# EAGLE design OLED Watch Original Design (EAGLE 9.0.1)
Assembly variants: DNP
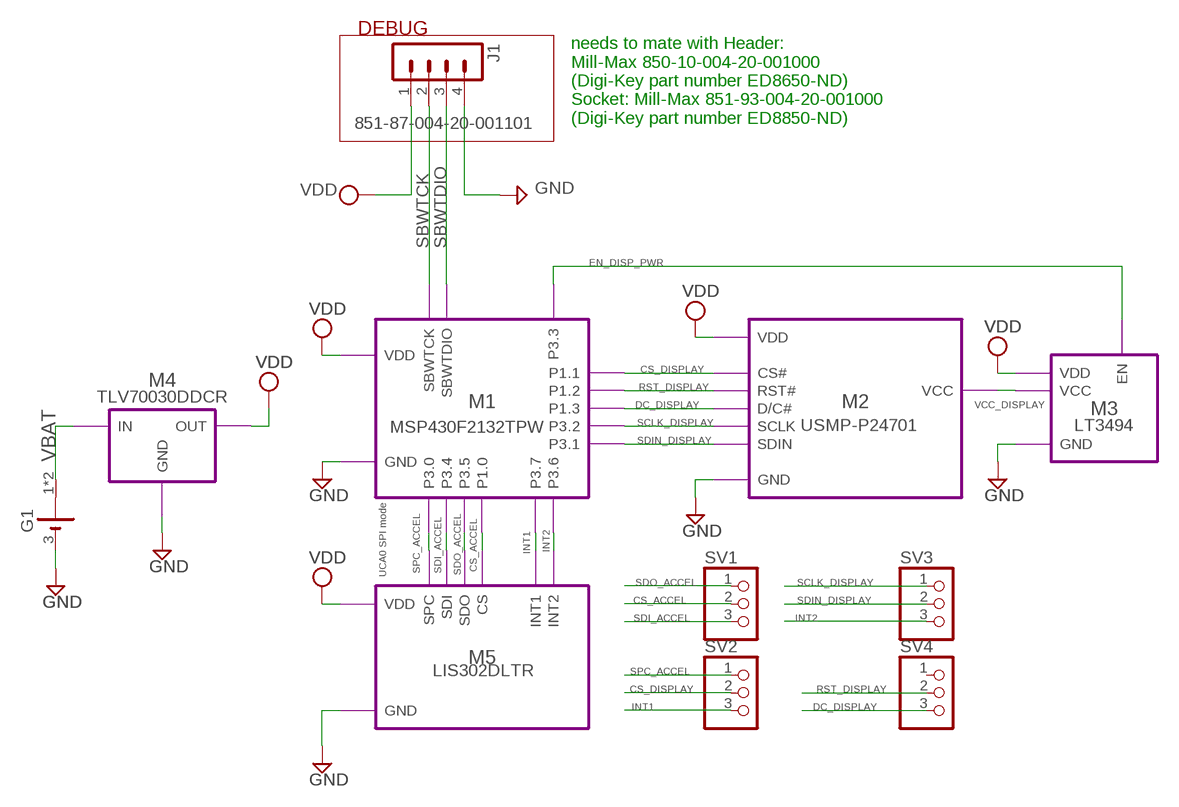
[diagram p0: schematic, sheet 1]

## Parts
G1  CR2025H  [CR2025H]
J1  851-87-004-20-001101  [851-87-004-20-001101]  (not fitted in variant DNP)
SV1  PINHD-1X3  [1X03]  (not fitted in variant DNP)
SV2  PINHD-1X3  [1X03]  (not fitted in variant DNP)
SV3  PINHD-1X3  [1X03]  (not fitted in variant DNP)
SV4  PINHD-1X3  [1X03]  (not fitted in variant DNP)

## Module instances
M1 = PROCESSOR
M5 = ACCEL
M2 = DISPLAY
M3 = DPWR
M4 = VREG

## Nets
CS_ACCEL: SV1.2 ; port M1.P1.0 M5.CS
CS_DISPLAY: SV2.2 ; port M1.P1.1 M2.CS#
DC_DISPLAY: SV4.3 ; port M1.P1.3 M2.D/C#
EN_DISP_PWR: port M1.P3.3 M3.EN
GND: G1.3(-) J1.4 ; port M5.GND M2.GND M3.GND M1.GND M4.GND
INT1: SV2.3 ; port M1.P3.7 M5.INT1
INT2: SV3.3 ; port M1.P3.6 M5.INT2
RST_DISPLAY: SV4.2 ; port M1.P1.2 M2.RST#
SBWTCK: J1.2 ; port M1.SBWTCK
SBWTDIO: J1.3 ; port M1.SBWTDIO
SCLK_DISPLAY: SV3.1 ; port M1.P3.2 M2.SCLK
SDI_ACCEL: SV1.3 ; port M1.P3.4 M5.SDI
SDIN_DISPLAY: SV3.2 ; port M1.P3.1 M2.SDIN
SDO_ACCEL: SV1.1 ; port M1.P3.5 M5.SDO
SPC_ACCEL: SV2.1 ; port M1.P3.0 M5.SPC
VBAT: G1.1(+) G1.2(+) ; port M4.IN
VCC_DISPLAY: port M3.VCC M2.VCC
VDD: J1.1 ; port M2.VDD M1.VDD M3.VDD M5.VDD M4.OUT
Unconnected: SV4.1

## Notes on the sheet
- DEBUG
- needs to mate with Header: 
  Mill-Max 850-10-004-20-001000 
  (Digi-Key part number ED8650-ND)
  Socket: Mill-Max 851-93-004-20-001000 
  (Digi-Key part number ED8850-ND)
- TLV70030DDCR
- MSP430F2132TPW | USMP-P24701 | LT3494
- UCA0 SPI mode
- LIS302DLTR

## Library data of the parts
G1 = OLED Watch Original Library:CR2025H: LI BATTERY Panasonic
J1 = ewpartswatch@1:851-87-004-20-001101: 4 Position Socket Connector 0.050" (1.27mm) Through Hole, Right Angle Gold Digikey: 1212-1347-ND http://www.precidip.com/AppHost/9696,1/Scripts/Modules/Catalog/Default.aspx?c=7&i=204&p=80&pdf=1&dsku=851-PP-NNN-20-001101
SV1-SV4 = pinhead:PINHD-1X3: PIN HEADER

## Module PROCESSOR
Ports: VDD(pwr) GND(pwr) P3.1(out) P3.2(out) P1.3(out) P1.2(out) P1.1(out) P3.0(out) P3.4(out) P3.5(in) P3.7(in) P3.6(in) P1.0(out) P3.3(out) SBWTCK(io) SBWTDIO(io)
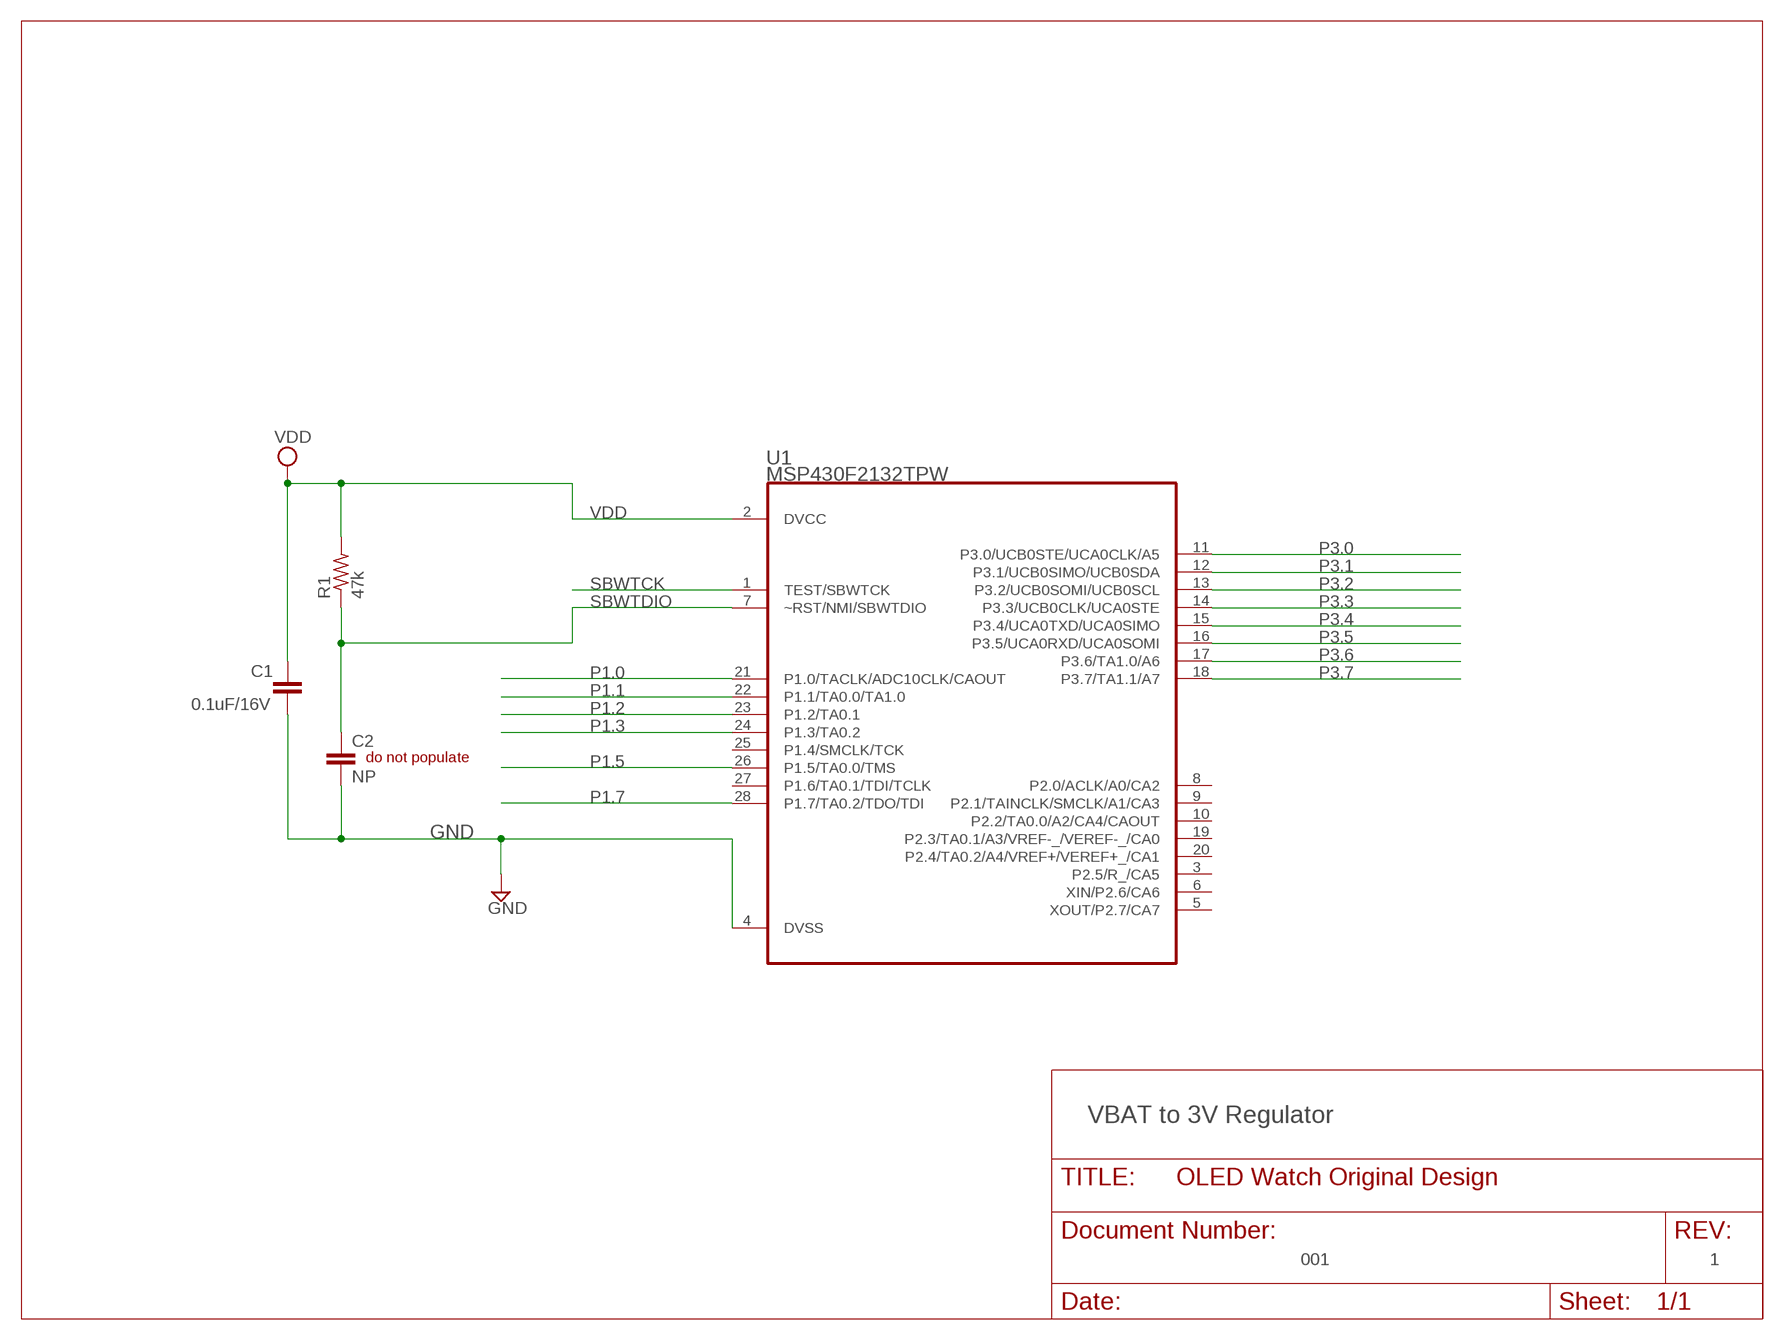
[diagram p1: schematic, module PROCESSOR, sheet 1]

### Parts
C1  0.1uF/16V  C-EUC0603  [C0603]
C2  NP  C-EUC0603  [C0603]  (not fitted in variant DNP)
R1  47k  R-US_R0603  [R0603]
U1  MSP430F2132TPW  [SOP-28N]

### Nets
GND: C1.2 C2.2 U1.4(DVSS)
P1.0: U1.21(P1.0/TACLK/ADC10CLK/CAOUT)
P1.1: U1.22(P1.1/TA0.0/TA1.0)
P1.2: U1.23(P1.2/TA0.1)
P1.3: U1.24(P1.3/TA0.2)
P1.5: U1.26(P1.5/TA0.0/TMS)
P1.7: U1.28(P1.7/TA0.2/TDO/TDI)
P3.0: U1.11(P3.0/UCB0STE/UCA0CLK/A5)
P3.1: U1.12(P3.1/UCB0SIMO/UCB0SDA)
P3.2: U1.13(P3.2/UCB0SOMI/UCB0SCL)
P3.3: U1.14(P3.3/UCB0CLK/UCA0STE)
P3.4: U1.15(P3.4/UCA0TXD/UCA0SIMO)
P3.5: U1.16(P3.5/UCA0RXD/UCA0SOMI)
P3.6: U1.17(P3.6/TA1.0/A6)
P3.7: U1.18(P3.7/TA1.1/A7)
SBWTCK: U1.1(TEST/SBWTCK)
SBWTDIO: C2.1 R1.1 U1.7(~RST/NMI/SBWTDIO)
VDD: C1.1 R1.2 U1.2(DVCC)
Unconnected: U1.3(P2.5/R_/CA5) U1.5(XOUT/P2.7/CA7) U1.6(XIN/P2.6/CA6) U1.8(P2.0/ACLK/A0/CA2) U1.9(P2.1/TAINCLK/SMCLK/A1/CA3) U1.10(P2.2/TA0.0/A2/CA4/CAOUT) U1.19(P2.3/TA0.1/A3/VREF-_/VEREF-_/CA0) U1.20(P2.4/TA0.2/A4/VREF+/VEREF+_/CA1) U1.25(P1.4/SMCLK/TCK) U1.27(P1.6/TA0.1/TDI/TCLK)

### Notes on the sheet
- do not populate
- VBAT to 3V Regulator
- 001 | 1

### Library data of the parts
C1 = rcl:C-EU: CAPACITOR, European symbol; DIGIKEY: 1276-2448-1-ND; SPICEPREFIX: C
C2 = rcl:C-EU: CAPACITOR, European symbol; DIGIKEY: 478-10068-1-ND; SPICEPREFIX: C
R1 = rcl:R-US_: RESISTOR, American symbol; DIGIKEY: 311-47KGRCT-ND; SPICEPREFIX: R
U1 = OLED Watch Original Library:MSP430F2132TPW: MIXED SIGNAL MICROCONTROLLER; DIGIKEY: 296-26202-5-ND

## Module ACCEL
Ports: VDD(pwr) GND(pwr) INT2(out) INT1(out) SDI(in) SDO(out) SPC(in) CS(in)
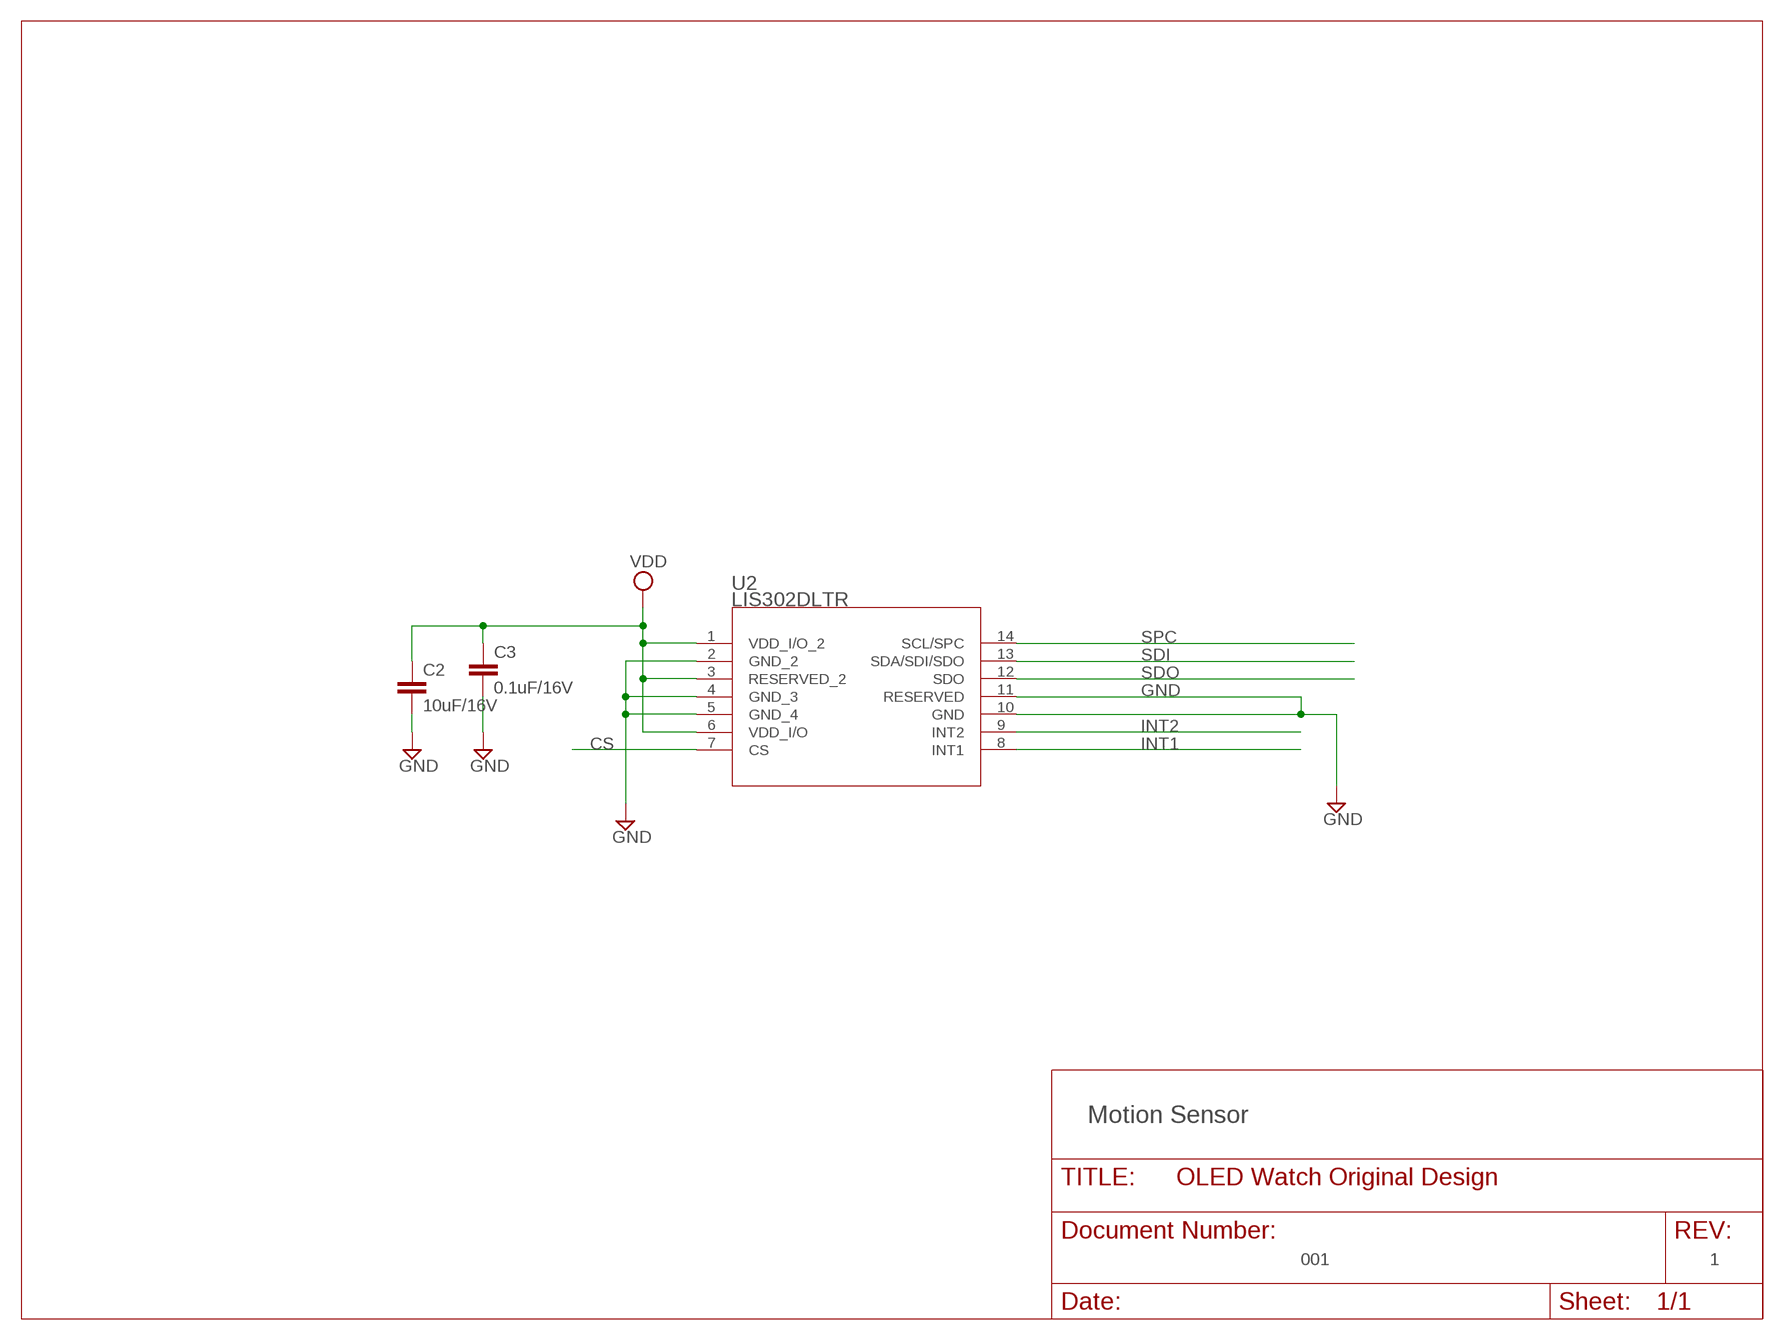
[diagram p2: schematic, module ACCEL, sheet 1]

### Parts
C2  10uF/16V  C-EUC0603  [C0603]
C3  0.1uF/16V  C-EUC0603  [C0603]
U2  LIS302DLTR  [LGA-14]

### Nets
CS: U2.7(CS)
GND: C2.2 C3.2 U2.2(GND_2) U2.4(GND_3) U2.5(GND_4) U2.10(GND) U2.11(RESERVED)
INT1: U2.8(INT1)
INT2: U2.9(INT2)
SDI: U2.13(SDA/SDI/SDO)
SDO: U2.12(SDO)
SPC: U2.14(SCL/SPC)
VDD: C2.1 C3.1 U2.1(VDD_I/O_2) U2.3(RESERVED_2) U2.6(VDD_I/O)

### Notes on the sheet
- Motion Sensor
- 001 | 1

### Library data of the parts
C2 = rcl:C-EU: CAPACITOR, European symbol; SPICEPREFIX: C
C3 = rcl:C-EU: CAPACITOR, European symbol; DIGIKEY: 1276-2448-1-ND; SPICEPREFIX: C
U2 = OLED Watch Original Library:LIS302DLTR; DIGIKEY: 497-5911-1-ND

## Module DISPLAY
Ports: VDD(pwr) GND(pwr) CS#(in) RST#(in) D/C#(in) SCLK(in) SDIN(in) VCC(pwr)
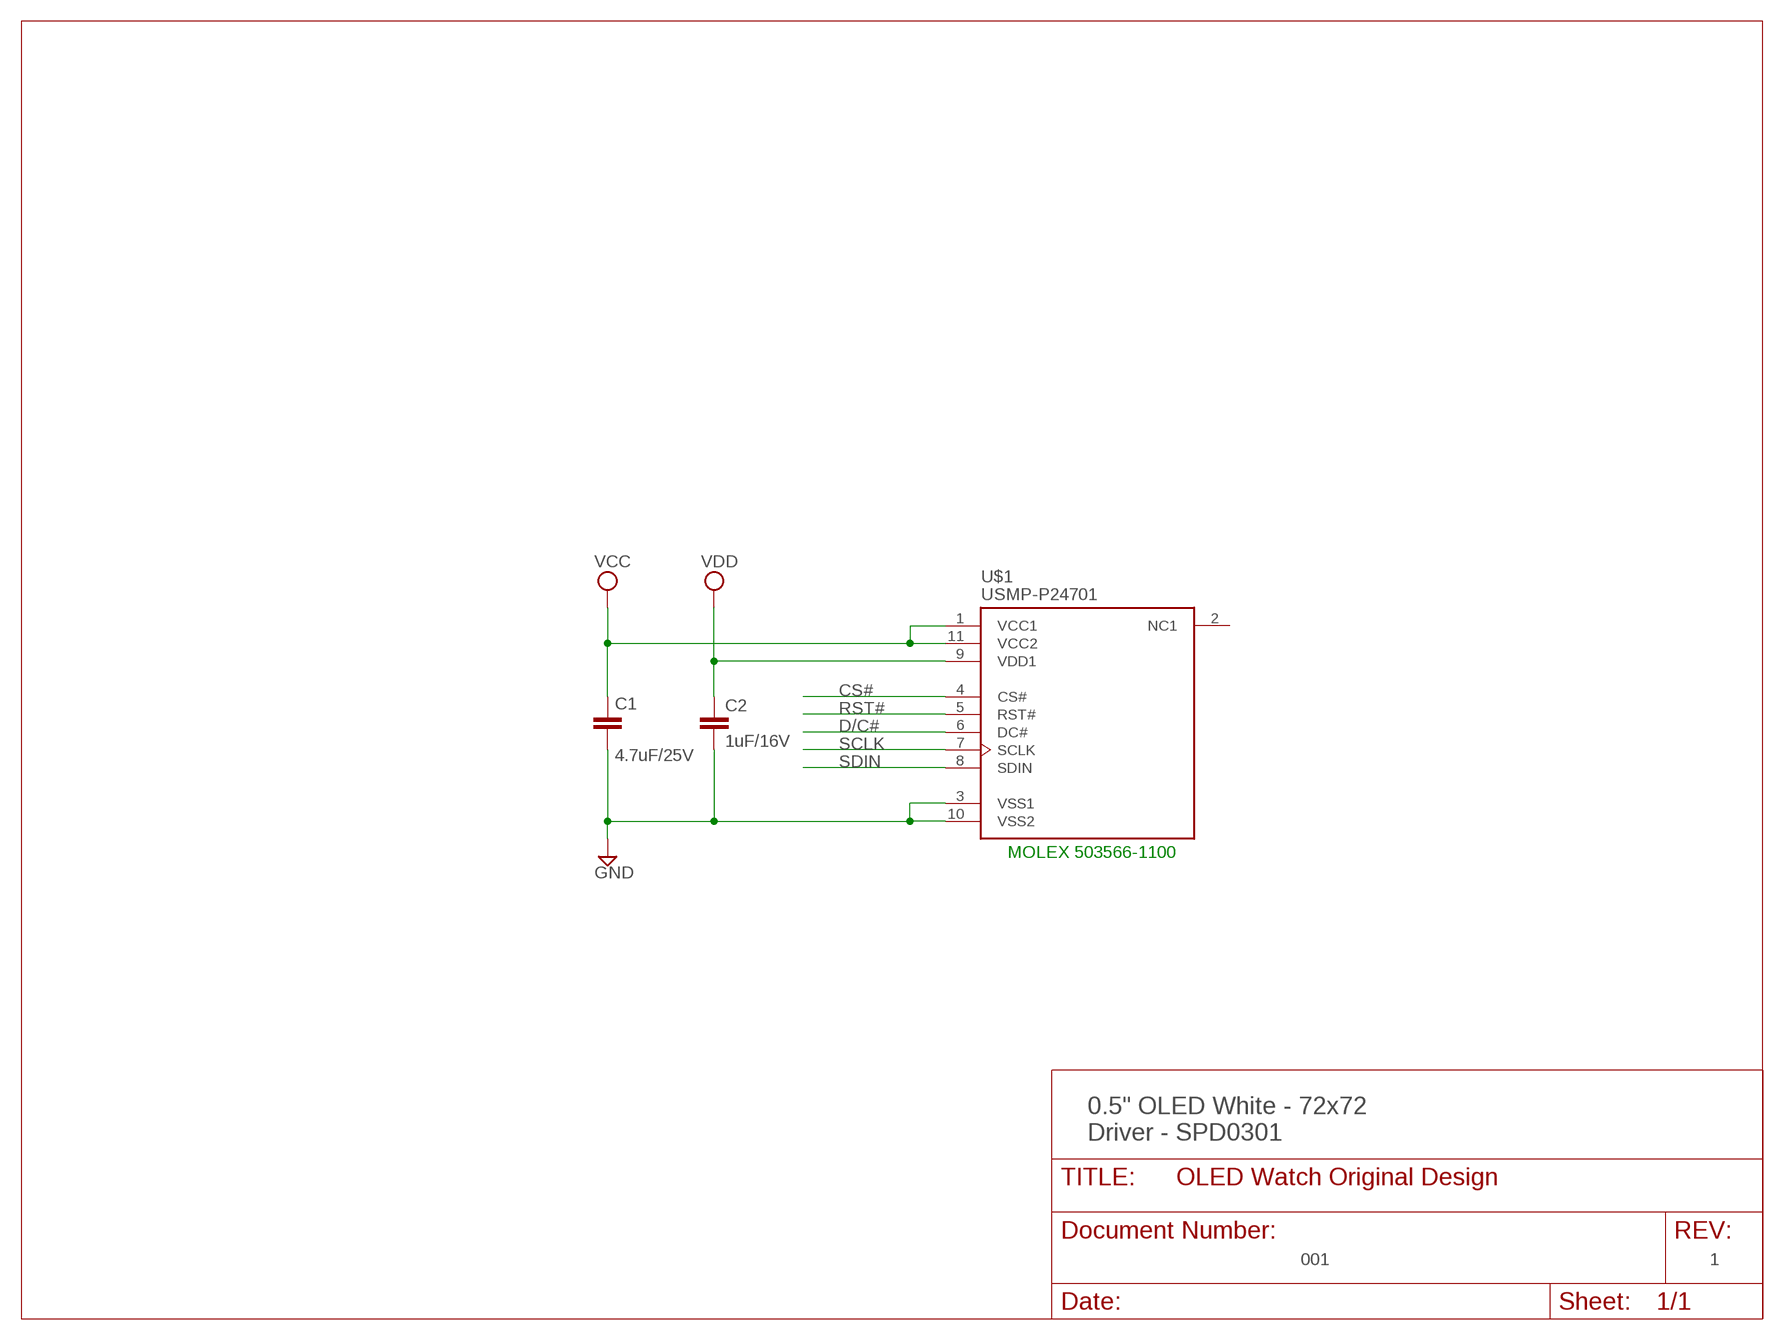
[diagram p3: schematic, module DISPLAY, sheet 1]

### Parts
C1  4.7uF/25V  C-EUC0805  [C0805]
C2  1uF/16V  C-EUC0603  [C0603]
U$1  USMP-P24701  [USMP-P24701]

### Nets
CS#: U$1.4(CS#)
D/C#: U$1.6(DC#)
GND: C1.2 C2.2 U$1.3(VSS1) U$1.10(VSS2)
RST#: U$1.5(RST#)
SCLK: U$1.7(SCLK)
SDIN: U$1.8(SDIN)
VCC: C1.1 U$1.1(VCC1) U$1.11(VCC2)
VDD: C2.1 U$1.9(VDD1)
Unconnected: U$1.2(NC1)

### Notes on the sheet
- MOLEX 503566-1100
- 0.5" OLED White - 72x72
  Driver - SPD0301
- 001 | 1

### Library data of the parts
C1 = rcl:C-EU: CAPACITOR, European symbol; DIGIKEY: 478-8508-1-ND; SPICEPREFIX: C
C2 = rcl:C-EU: CAPACITOR, European symbol; DIGIKEY: 399-8001-1-ND; SPICEPREFIX: C
U$1 = OLED Watch Original Library:USMP-P24701: US Micro P24701 0.5" OLED WHITE, 72x32, COG, SPD0301

## Module DPWR
Ports: GND(pwr) VDD(pwr) VCC(pwr) EN(in)
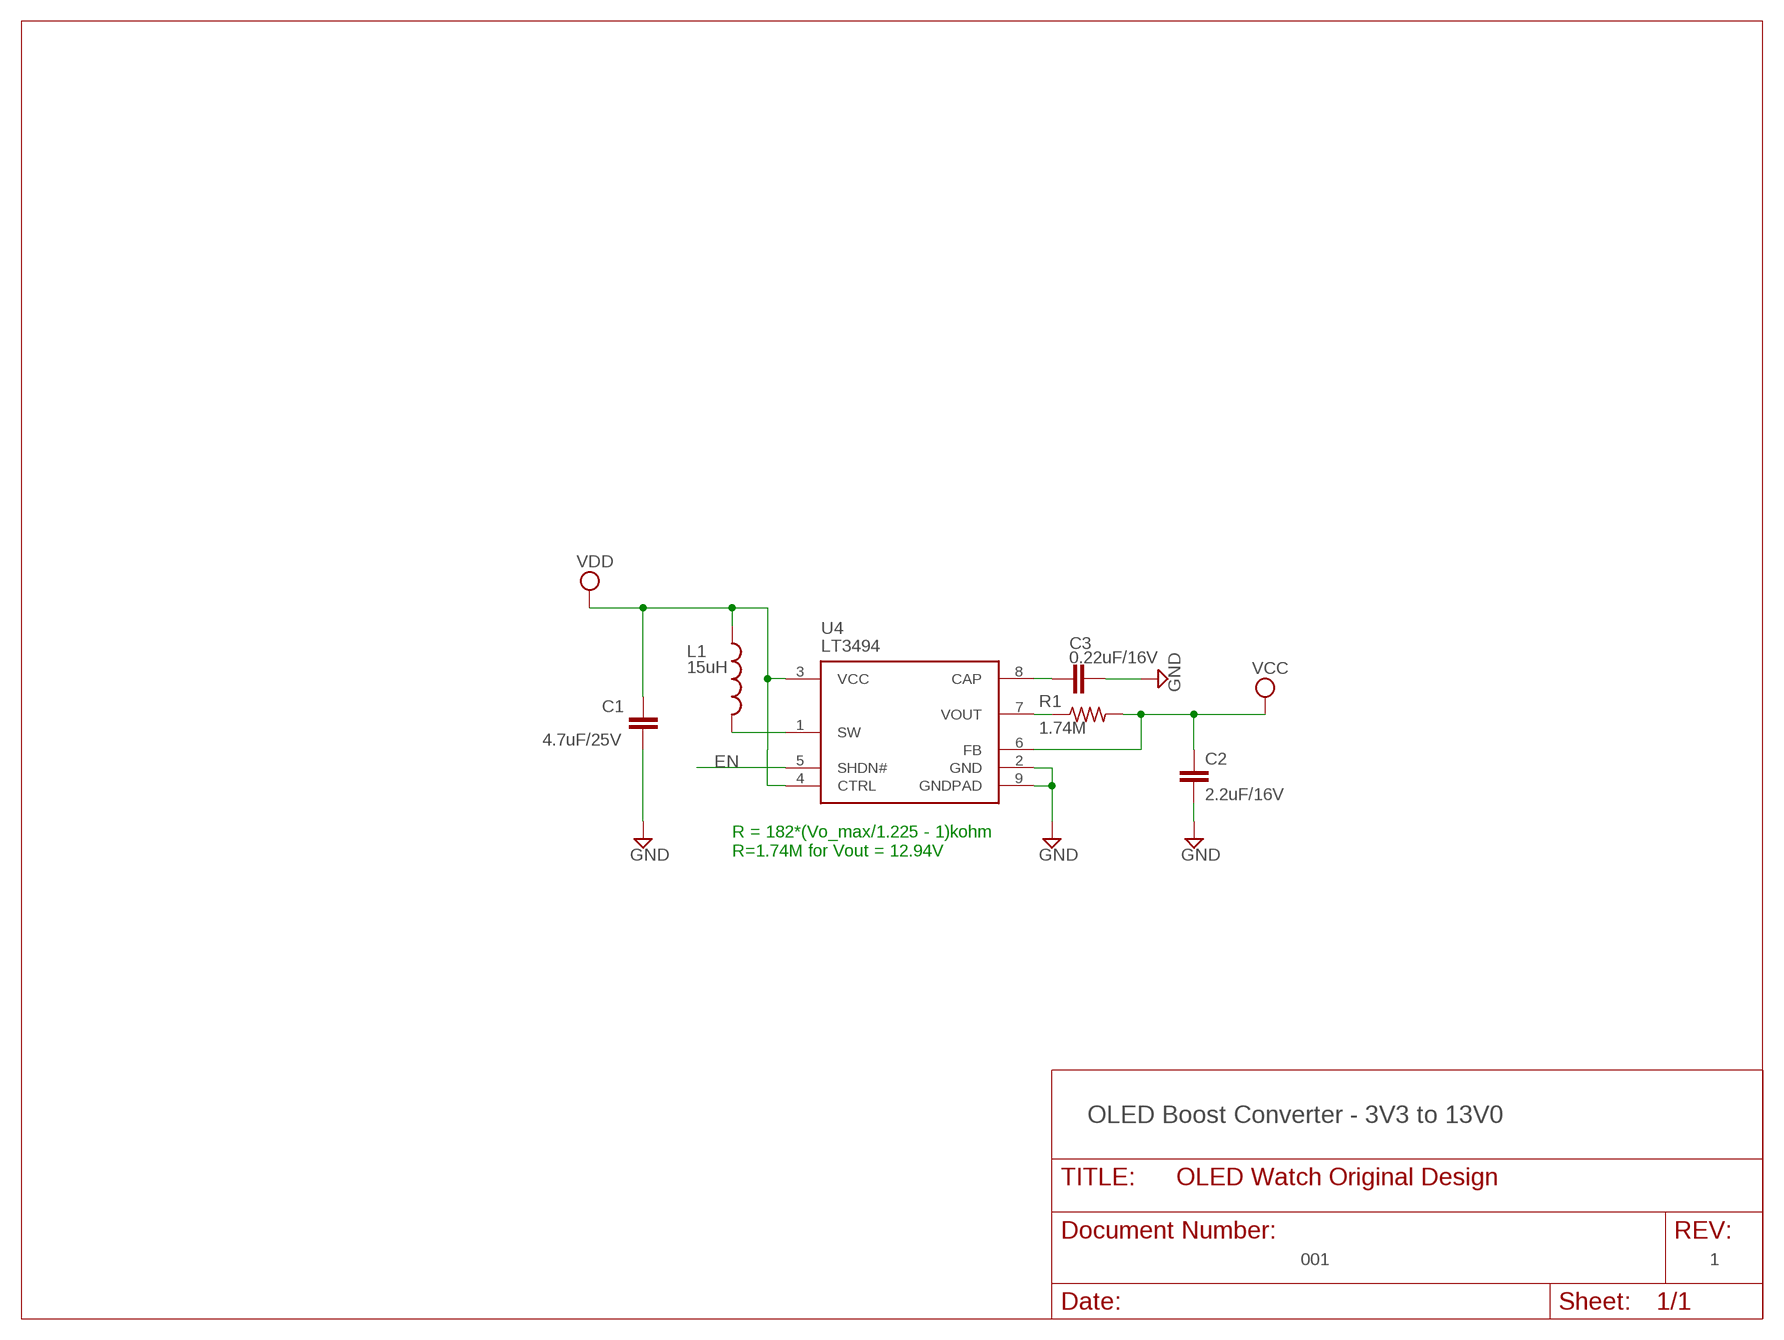
[diagram p4: schematic, module DPWR, sheet 1]

### Parts
C1  4.7uF/25V  C-EUC0805  [C0805]
C2  2.2uF/16V  C-EUC0603  [C0603]
C3  0.22uF/16V  C-EUC0603  [C0603]
L1  15uH  L-USL1812  [L1812]
R1  1.74M  R-US_R0603  [R0603]
U4  LT3494  [DFN8-3X2-DDB]

### Nets
EN: U4.5(SHDN#)
GND: C1.2 C2.2 C3.2 U4.2(GND) U4.9(GNDPAD)
N$1: L1.2 U4.1(SW)
N$2: C3.1 U4.8(CAP)
N$4: R1.1 U4.7(VOUT)
VCC: C2.1 R1.2 U4.6(FB)
VDD: C1.1 L1.1 U4.3(VCC) U4.4(CTRL)

### Notes on the sheet
- R = 182*(Vo_max/1.225 - 1)kohm
  R=1.74M for Vout = 12.94V
- OLED Boost Converter - 3V3 to 13V0
- 001 | 1

### Library data of the parts
C1 = rcl:C-EU: CAPACITOR, European symbol; DIGIKEY: 478-8508-1-ND; SPICEPREFIX: C
C2 = rcl:C-EU: CAPACITOR, European symbol; DIGIKEY: 490-3906-1-ND; SPICEPREFIX: C
C3 = rcl:C-EU: CAPACITOR, European symbol; DIGIKEY: 1276-1284-1-ND; SPICEPREFIX: C
L1 = rcl:L-US: INDUCTOR, American symbol; DIGIKEY: 445-6414-1-ND; SPICEPREFIX: L
R1 = rcl:R-US_: RESISTOR, American symbol; DIGIKEY: 541-1.74MHCT-ND; SPICEPREFIX: R
U4 = OLED Watch Original Library:LT3494: Micropower Low Noise Boost Converters with Output Disconnect http://cds.linear.com/docs/en/datasheet/3494fb.pdf; DIGIKEY: LT3494AEDDB#TRMPBFCT-ND

## Module VREG
Ports: IN(pwr) OUT(pwr) GND(pwr)
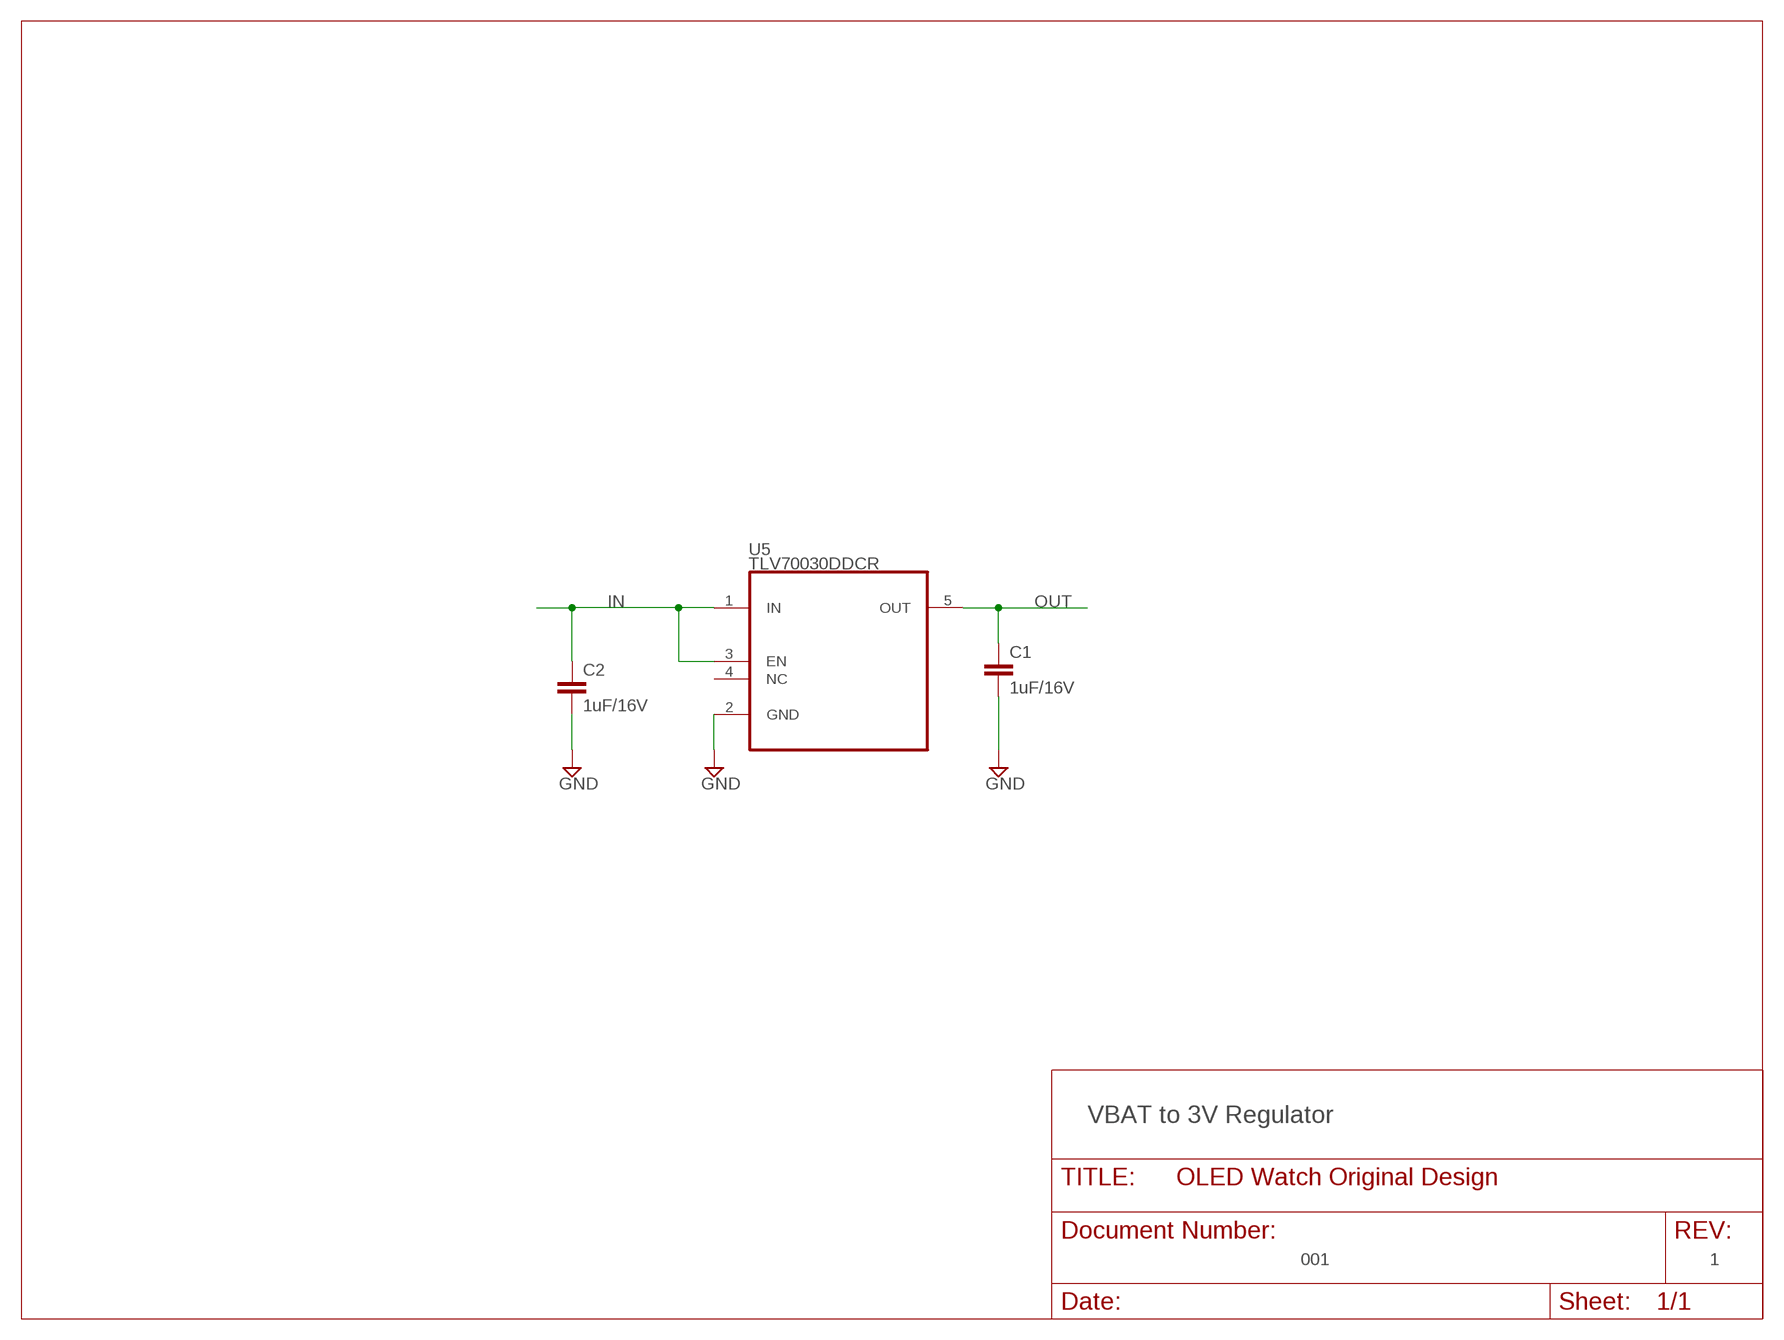
[diagram p5: schematic, module VREG, sheet 1]

### Parts
C1  1uF/16V  C-EUC0603  [C0603]
C2  1uF/16V  C-EUC0603  [C0603]
U5  TLV70030DDCR  [SOT95P280X110-5]

### Nets
GND: C1.2 C2.2 U5.2(GND)
IN: C2.1 U5.1(IN) U5.3(EN)
OUT: C1.1 U5.5(OUT)
Unconnected: U5.4(NC)

### Notes on the sheet
- VBAT to 3V Regulator
- 001 | 1

### Library data of the parts
C1 C2 = rcl:C-EU: CAPACITOR, European symbol; DIGIKEY: 399-8001-1-ND; SPICEPREFIX: C
U5 = OLED Watch Original Library:TLV70030DDCR: TLV700xx-Q1 200-mA Low-IQ Low-Dropout Regulator for Portable Devices

## Net classes
0 default: width 0.203 mm, drill 0.203 mm, clearance 0.203 mm

## Board
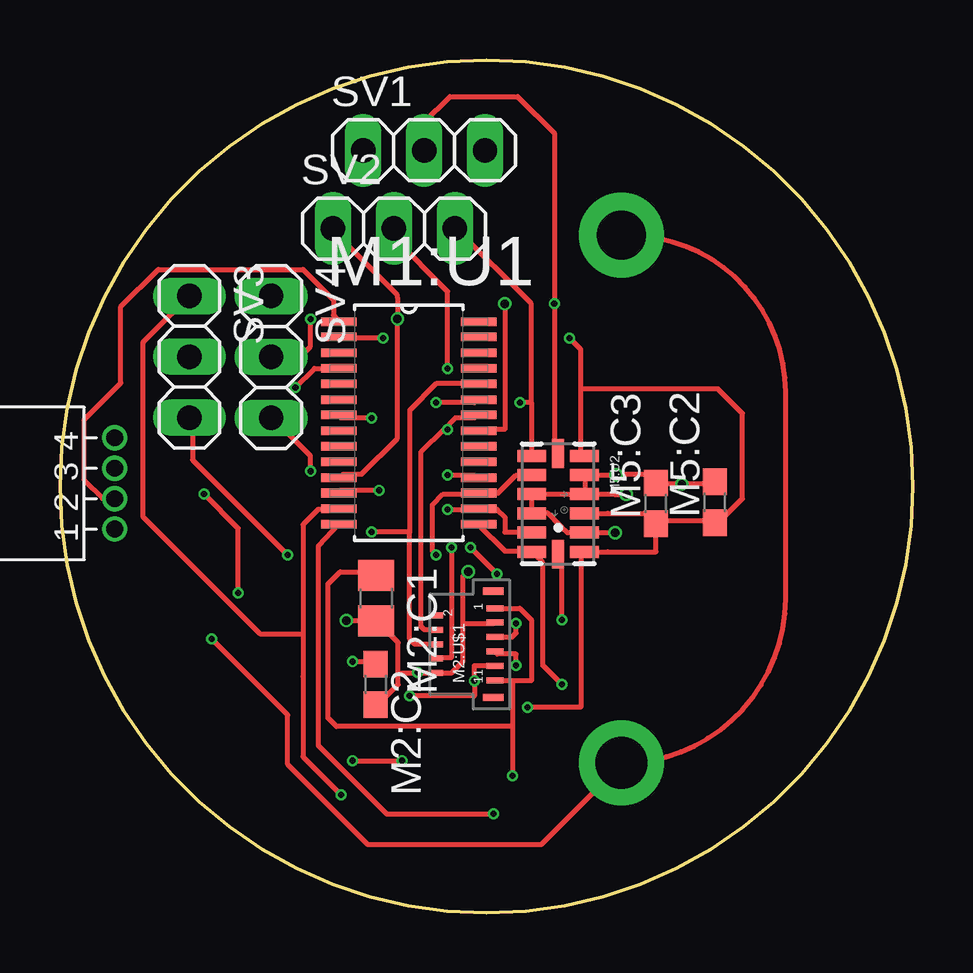
[diagram p6: board, top side]
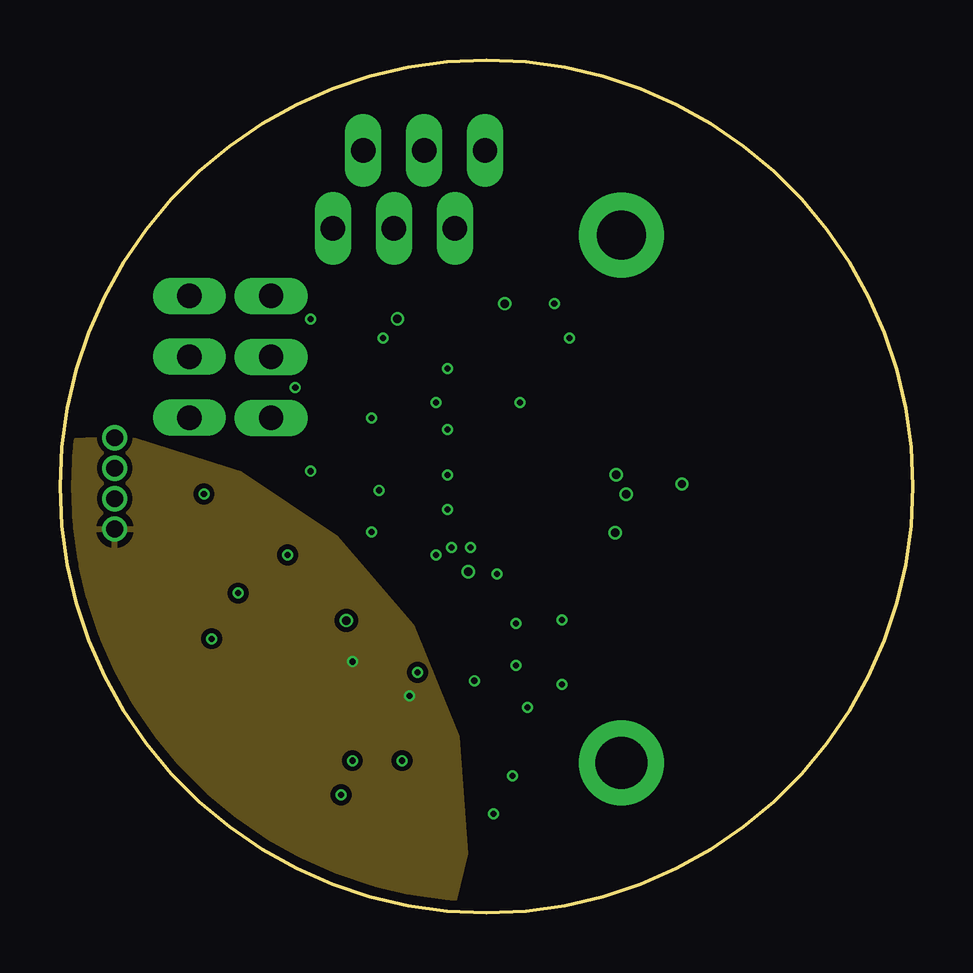
[diagram p7: board, inner layer Route2]
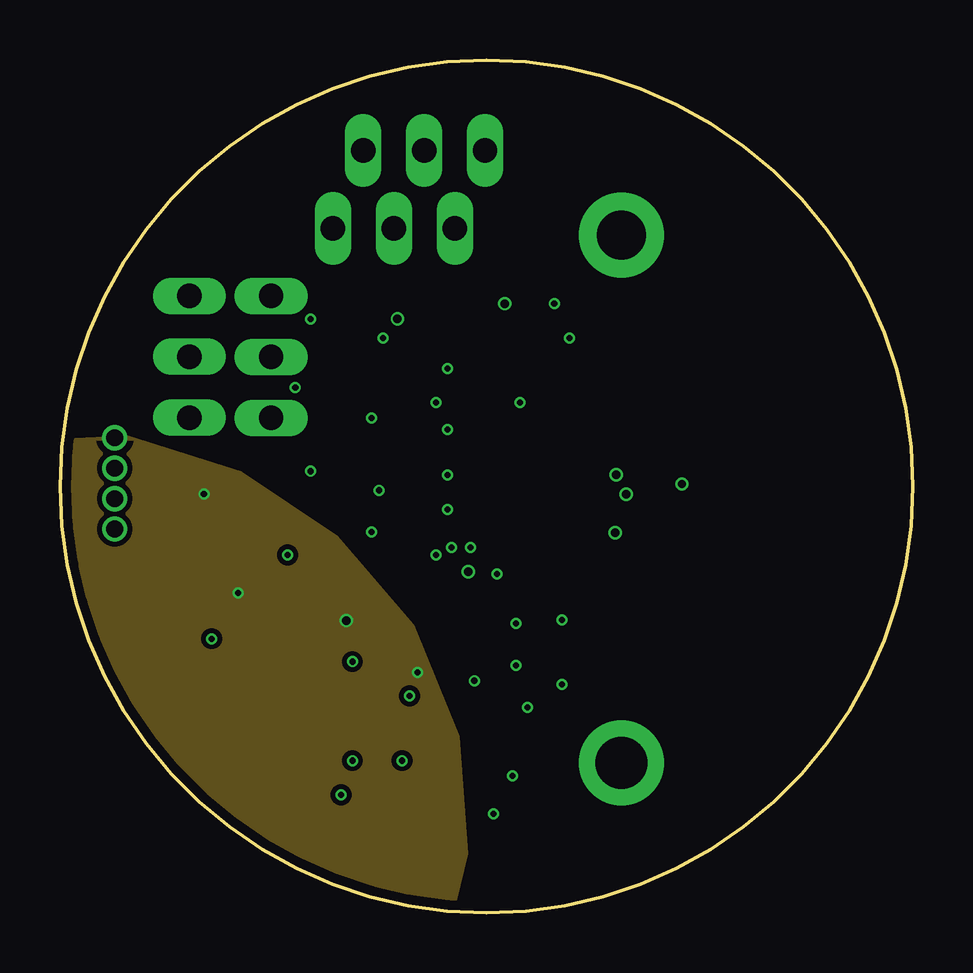
[diagram p8: board, inner layer Route15]
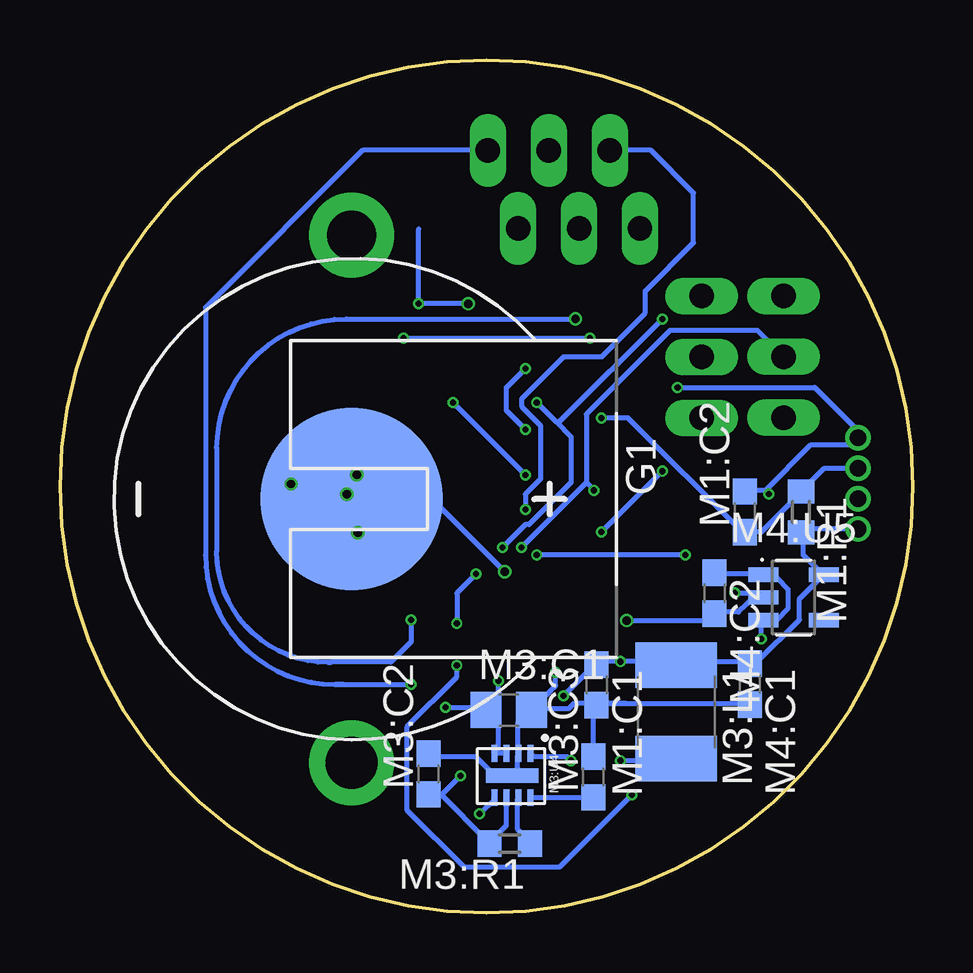
[diagram p9: board, bottom side, seen from below]

Size 35.56 x 35.56 mm. Coordinates in mm from the lower left corner, seen from the top.
Outline: 17.78,0 arc90 35.56,17.78 arc90 17.78,35.56 arc90 0,17.78 arc90 17.78,0
Copper layers (1*16): Top 0.035559375mm / dielectric 0.17018125mm / Bottom 0.035559375mm
Design rules "OSHPark-4layer *": minimum track width 5mil, minimum drill 10mil, track to track 5mil, track to pad 5mil, pad to pad 5mil, via to via 5mil, smd to smd 5mil, copper to edge 15mil, drill to drill 6mil, minimum pad ring 4mil, minimum via ring 4mil, stop-mask expansion 2.5mil, vias tented up to drill 0mil, thermal gap 10mil

### Footprints (pad centres in the part's own frame; a part is rotated, then mirrored left to right if it is on the bottom)
CR2025H = drill 2.032 pad 3.556: 1 -11,0 | drill 2.159 pad 3.556: 2 11,0 | smd 7.62 x 7.62: 3 0,0
851-87-004-20-001101 = drill 0.7 pad 1: 1 3.81,0; 2 2.54,0; 3 1.27,0; 4 0,0
C0603 = smd 1.1 x 1: 1 -0.85,0; 2 0.85,0
R0603 = smd 1 x 1.1: 1 -0.85,0; 2 0.85,0
SOP-28N = smd 1.473 x 0.356: 1 -2.921,4.216; 2 -2.921,3.581; 3 -2.921,2.921; 4 -2.921,2.286; 5 -2.921,1.626; 6 -2.921,0.965; 7 -2.921,0.33; 8 -2.921,-0.33; 9 -2.921,-0.965; 10 -2.921,-1.626; 11 -2.921,-2.286; 12 -2.921,-2.921; 13 -2.921,-3.581; 14 -2.921,-4.216; 15 2.921,-4.216; 16 2.921,-3.581; 17 2.921,-2.921; 18 2.921,-2.286; 19 2.921,-1.626; 20 2.921,-0.965; 21 2.921,-0.33; 22 2.921,0.33; 23 2.921,0.965; 24 2.921,1.626; 25 2.921,2.286; 26 2.921,2.921; 27 2.921,3.581; 28 2.921,4.216
C0805 = smd 1.3 x 1.5: 1 -0.95,0; 2 0.95,0
USMP-P24701 = smd 0.25 x 0.72: 1 3,0; 3 2.4,0; 5 1.8,0; 7 1.2,0; 9 0.6,0; 11 0,0 | smd 0.25 x 0.52: 2 2.7,2.43; 4 2.1,2.43; 6 1.5,2.43; 8 0.9,2.43; 10 0.3,2.43 | smd 0.3 x 0.85: 12 -0.71,0.07; 13 3.71,0.07
L1812 = smd 1.9 x 3.4: 1 -1.95,0; 2 1.95,0
DFN8-3X2-DDB = smd 0.25 x 0.7: 1 0,0; 2 0.5,0; 3 1,0; 4 1.5,0; 5 1.5,1.85; 6 1,1.85; 7 0.5,1.85; 8 0,1.85 | smd 2.2 x 0.61: 9 0.75,0.925
SOT95P280X110-5 = smd 1.25 x 0.589: 1 -1.256,0.95; 2 -1.256,0; 3 -1.256,-0.95; 4 1.256,-0.95; 5 1.256,0.95
LGA-14 = smd 0.5 x 1.2: 1 2,1.1; 2 1.2,1.1; 3 0.4,1.1; 4 -0.4,1.1; 5 -1.2,1.1; 6 -2,1.1; 8 -2,-1.1; 9 -1.2,-1.1; 10 -0.4,-1.1; 11 0.4,-1.1; 12 1.2,-1.1; 13 2,-1.1 | smd 1.2 x 0.5: 7 -2.1,0; 14 2.1,0
1X03 = drill 1.016 long: 1 -2.54,0; 2 0,0; 3 2.54,0

### Placement (x,y rotation side)
G1  23.41,17.26 270 bottom
J1  2.29,19.81 270 top
M1:C1  0.1uF/16V  [C0603]  13.19,9.51 270 bottom
M1:C2  NP  [C0603]  7,16.72 90 bottom
M1:R1  47k  [R0603]  4.67,16.71 270 bottom
M1:U1  MSP430F2132TPW  [SOP-28N]  14.54,20.43 0 top
M2:C1  4.7uF/25V  [C0805]  13.18,13.12 270 top
M2:C2  1uF/16V  [C0603]  13.16,9.53 270 top
M2:U$1  USMP-P24701  [USMP-P24701]  18.14,9.7 90 top
M3:C1  4.7uF/25V  [C0805]  16.85,8.46 0 bottom
M3:C2  2.2uF/16V  [C0603]  20.19,5.79 90 bottom
M3:C3  0.22uF/16V  [C0603]  13.32,5.67 90 bottom
M3:L1  15uH  [L1812]  9.87,8.38 270 bottom
M3:R1  1.74M  [R0603]  16.81,2.89 180 bottom
M3:U4  LT3494  [DFN8-3X2-DDB]  15.96,6.66 180 bottom
M4:C1  1uF/16V  [C0603]  6.8,9.54 270 bottom
M4:C2  1uF/16V  [C0603]  8.28,13.33 270 bottom
M4:U5  TLV70030DDCR  [SOT95P280X110-5]  4.98,13.15 0 bottom
M5:C2  10uF/16V  [C0603]  27.31,17.12 90 top
M5:C3  0.1uF/16V  [C0603]  24.85,17.08 90 top
M5:U2  LIS302DLTR  [LGA-14]  20.77,17.06 270 top
SV1  15.18,31.79 0 top
SV2  13.92,28.54 0 top
SV3  5.4,23.19 270 top
SV4  8.8,23.18 270 top

### Tracks (layer width: path | path; a pad name or v marks a point on that pad's centre or on a via)
CS_ACCEL  (via drill 0.25, 0.35)
  Top 0.203: M5:U2.7 20.76,19.21 20.61,19.37 v20.61,25.4 20.61,32.51 19.08,34.04 16.26,34.04 15.18,32.96 SV1.2 | v18.54,25.4 18.54,20.16 17.47,20.16 M1:U1.21
  Bottom 0.203: 20.61,28.51 v20.61,25.4 v18.54,25.4
CS_DISPLAY  (via drill 0.25)
  Top 0.203: 16,20.16 16.48,20.64 17.27,20.64 M1:U1.22 | 16,20.16 15.05,19.21 15.05,11.95 15.19,11.8 M2:U$1.4 | v16.16,22.7 16.16,25.91 13.92,28.15 SV2.2 | 16,20.16 v16.16,20.16
  Bottom 0.203: v16.16,22.7 16.95,21.91 16.95,20.95 v16.16,20.16
DC_DISPLAY  (via drill 0.25)
  Top 0.203: 14.57,15.88 14.57,20.95 15.68,22.07 17.27,22.07 M1:U1.24 | 14.57,15.88 14.57,11.43 14.8,11.2 M2:U$1.6 | v10.45,18.41 10.45,19.05 8.86,20.64 SV4.3 | 14.57,15.88 v12.99,15.88
  Bottom 0.203: v12.99,15.88 v10.45,18.41
EN_DISP_PWR  (via drill 0.25)
  Top 0.203: M1:U1.14 10.76,15.3 10.76,6.98 13.62,4.13 v18.07,4.13
  Bottom 0.203: v18.07,4.13 17.43,4.76 M3:U4.5
GND  (via drill 0.25, 0.35)
  Top 0.203: v9.81,21.91 10.6,22.7 11.56,22.7 M1:U1.4 | M5:U2.4 21.88,17.46 21.88,18.26 M5:U2.5 23.18,18.26 v23.19,18.27 23.18,18.29 24.64,18.29 M5:C3.2 24.85,17.88 v25.93,17.88 27.31,17.88 M5:C2.2 | 19.65,16.67 19.65,17.3 M5:U2.10 19.81,17.46 21.72,17.46 M5:U2.4 | 19.65,16.67 M5:U2.11 | 27.43,17.94 M5:C2.2 | 14.1,10 14.89,10 | 14.89,10 15.68,10 M2:U$1.10 15.84,10 16.32,10 16.8,10.48 16.8,12.07 | 14.1,10 14.1,9.52 13.3,8.73 M2:C2.2 | 16.8,12.07 18.07,12.07 M2:U$1.3 | 14.1,10 14.1,11.27 13.3,12.07 M2:C1.2 11.93,12.17 11.91,12.16 11.94,12.18 v11.94,12.19 | v14.9,10.03 14.89,10 | v6,17.46 7.43,16.03 v7.43,13.34 | 19.65,16.51 19.65,16.67 | 27.26,17.92 arc90 M5:C2.2 | 21.39,15.86 M5:U2.2 | 16.8,12.07 16.8,14.03 17.03,14.26 17.02,14.25 v17.02,14.22 | M5:U2.2 21.15,15.86 20.92,16.09 | 20.59,16.41 20.92,16.09 | 20.92,16.09 20.33,16.67 19.65,16.67 | M5:U2.4 23.11,17.46 | 23.11,17.45 v23.6,17.45 | M5:U2.2 23.17,15.86 v23.14,15.86 v23.14,15.85
  Bottom 0.203: 6.16,17.62 6.95,17.62 M1:C2.2 | 6.16,17.62 4.25,19.53 2.29,19.53 J1.4 2.29,20.1 4.1,21.91 v9.81,21.91 | M3:C2.2 20.13,6.51 18.22,6.51 17.59,5.87 16.8,5.87 M3:U4.9 16.64,5.87 16.48,6.03 16.48,6.51 M3:U4.2 16.48,6.67 16.48,7.94 16,8.41 M3:C1.2 15.61,8.75 | 8.23,12.54 8.22,12.54 7.27,12.54 6.95,12.86 6.79,13.02 6.32,13.02 M4:U5.2 6.42,13.34 v7.43,13.34 | 8.23,12.54 M4:C2.2 | 13.14,8.73 11.94,8.73 | 11.94,8.73 6.95,8.73 M4:C1.2 | 13.14,8.73 M1:C1.2 | v6,17.46 6.16,17.62 | 15.61,8.75 15.11,9.25 15.11,9.27 14.9,9.47 v14.9,10.03 | M3:C3.2 13.32,8.56 13.14,8.73 | v23.6,17.45 23.94,17.79 | G1.3 23.41,17.45 v23.6,17.45 | G1.3 23.41,17.78 24.89,17.78 | G1.3 23.41,17.88 v25.93,17.88 | v23.14,15.85 23.14,17.45 v23.6,17.45 | v17.02,14.22 20.05,17.26 G1.3 | v11.94,12.19 8.57,12.19 8.23,12.54 | 11.94,8.73 14.14,8.73 14.35,8.52 14.9,8.52 14.9,8.51 15.37,8.51 15.61,8.75
  pour Route15: 2.79,19.84 7.54,18.34 11.53,15.67 14.71,11.99 16.59,7.34 16.94,2.49 15.85,-2.08 13.67,-6.32 10.19,-9.83 5.66,-11.99 1.02,-12.8 -3.61,-12.22 -8.15,-10.16 -11.86,-6.88 -14.27,-2.64 -15.37,2.06 -15.11,6.98 -13.39,11.48 -10.41,15.44 -6.45,18.19 -1.96,19.61
INT1  (via drill 0.25)
  Top 0.203: 19.65,21.27 19.65,25.4 16.52,28.54 SV2.3 | 19.65,21.27 19.65,19.21 M5:U2.8 | v16.16,18.26 17.27,18.26 M1:U1.18 | 19.65,21.27 v19.18,21.27
  Bottom 0.203: v19.18,21.27 v16.16,18.26
INT2  (via drill 0.25)
  Top 0.203: v15.68,14.92 15.53,15.08 15.53,17.02 15.97,17.46 17.27,17.46 M1:U1.17 18.27,17.5 19.02,18.26 M5:U2.9 | v9.49,14.92 5.52,18.89 5.52,20.64 SV3.3
  Bottom 0.203: v9.49,14.92 v15.68,14.92
M3:N$1  (via drill 0.25)
  Top 0.203: v12.19,6.35 v14.26,6.35
  Bottom 0.203: v14.26,6.35 14.42,6.51 15.81,6.51 M3:U4.1 | v12.19,6.35 9.97,6.35 M3:L1.2
M3:N$2
  Bottom 0.203: M3:C3.1 13.41,4.82 13.42,4.81 M3:U4.8
M3:N$4
  Bottom 0.203: M3:U4.7 16.48,4.76 16.48,3.49 16,3.02 M3:R1.1
RST_DISPLAY  (via drill 0.25)
  Top 0.203: v19.02,12.07 19.02,11.67 18.85,11.5 M2:U$1.5 | v15.68,21.27 17.27,21.27 M1:U1.23 | v10.45,24.77 10.45,23.62 10,23.18 SV4.2 | v17.11,15.24 v18.22,14.13
  Bottom 0.203: v19.02,12.07 19.02,13.34 v18.22,14.13 | v17.11,15.24 16.16,16.19 16,16.19 14.26,17.94 14.26,19.84 14.89,20.48 | v15.68,21.27 14.89,20.48 | v10.45,24.77 14.73,20.48 14.89,20.48
SBWTCK
  Top 0.203: M1:U1.1 11.56,24.77 11.4,24.92 11.4,25.56 10.13,26.83 4.1,26.83 2.54,25.27 2.54,22.1 1.02,20.57 1.02,18.03 1.78,17.27 J1.2
SBWTDIO  (via drill 0.25)
  Top 0.203: v12.99,20.64 11.72,20.64 M1:U1.7
  Bottom 0.203: M1:R1.1 4.73,17.46 6.32,15.88 6.95,15.88 M1:C2.1 7.11,15.88 11.88,20.64 v12.99,20.64 | 4.57,17.62 M1:R1.1 | M1:R1.1 3.69,18.54 J1.3
SCLK_DISPLAY  (via drill 0.25)
  Top 0.203: v19.02,10.32 19.02,10.8 18.22,10.8 M2:U$1.7 | v11.72,4.92 10.13,6.51 10.13,9.84 10.13,11.68 | 10.13,11.68 10.13,16.19 10.76,16.83 11.56,16.83 M1:U1.13 | SV3.1 3.46,23.79 3.46,16.51 8.33,11.64 10.08,11.64 10.13,11.68
  Bottom 0.203: v19.02,10.32 19.02,9.84 21.08,7.78 21.08,4.29 18.7,1.91 14.73,1.91 v11.72,4.92
SDI_ACCEL  (via drill 0.25)
  Top 0.203: v20.92,9.52 20.13,10.32 20.13,14.61 19.81,14.92 M5:U2.13 19.64,15.08 18.54,15.08 17.42,16.2 M1:U1.15
  Bottom 0.203: 24.1,9.52 23.72,9.52 | 23.72,9.52 v20.92,9.52 | 23.72,9.52 24.1,9.52 | 24.1,9.52 arc90 29.5,14.92 29.5,25.24 22.94,31.79 SV1.3
SDIN_DISPLAY  (via drill 0.25)
  Top 0.203: v16.32,15.24 16.32,10.64 15.84,10.64 M2:U$1.8 | v13.3,17.62 11.72,17.62 M1:U1.12
  Bottom 0.203: 13.62,17.94 v16.32,15.24 | 13.62,17.94 13.62,20.8 10.13,24.29 6.48,24.29 5.52,23.34 SV3.2 | 13.62,17.94 v13.3,17.62
SDO_ACCEL  (via drill 0.25)
  Top 0.203: v16.16,16.83 17.27,16.83 M1:U1.16 17.44,16.83 18.22,16.83 18.54,16.51 18.54,15.88 19.65,15.88 M5:U2.12
  Bottom 0.203: v16.16,16.83 16.16,17.46 15.53,18.1 15.53,20.32 16.32,21.11 16.32,21.43 14.57,23.18 12.99,23.18 11.16,25.01 11.16,25.93 9.14,27.94 9.14,30.01 10.92,31.79 SV1.1
SPC_ACCEL  (via drill 0.25, 0.35)
  Top 0.203: v20.92,12.22 20.92,14.92 M5:U2.14 | M1:U1.11 11.81,18.3 12.58,18.3 14.07,19.78 v14.07,24.77 14.07,25.65 14.07,25.75 11.38,28.44 SV2.1
  Bottom 0.203: 29.02,19.37 29.02,19.25 | 29.02,19.25 29.02,15.08 arc-90 24.38,10.44 24.28,10.44 24.26,10.46 21.77,10.46 20.92,11.31 v20.92,12.22 | 29.02,19.37 arc90 23.62,24.77 14.13,24.77 14.12,24.77 v14.07,24.77 | 29.02,19.37 29.02,19.25
VBAT  (via drill 0.25)
  Top 0.203: v6.32,11.43 9.49,8.25 9.49,6.19 12.83,2.86 20.07,2.86 23.31,6.1 23.31,6.19 G1.2 | 23.46,28.1 23.42,28.22 | 23.42,28.22 G1.1 | 23.46,6.35 G1.2 | G1.2 arc90 30.25,13.1 30.25,21.72 arc90 23.75,28.22 23.42,28.22
  Bottom 0.203: M4:C2.1 8.22,14.13 6.32,14.13 M4:U5.1 6.16,13.97 5.68,13.97 5.21,13.49 5.21,12.7 5.68,12.22 6.16,12.22 M4:U5.3 6.32,12.07 v6.32,11.43
VCC_DISPLAY  (via drill 0.25)
  Top 0.203: 18.86,9.68 19.65,9.68 19.65,12.22 19.18,12.7 18.22,12.7 M2:U$1.1 | 18.86,9.68 18.22,9.68 M2:U$1.11 | 18.86,9.68 18.86,7.78 | 18.86,7.78 v18.86,5.71 | M2:C1.1 13.03,14.22 11.68,14.22 11.17,13.71 11.17,10.67 11.18,10.67 11.18,8.13 11.52,7.78 18.86,7.78
  Bottom 0.203: M3:U4.6 16.95,4.76 16.95,3.65 17.59,3.02 M3:R1.2 17.75,3.02 19.65,4.92 | 19.65,4.92 20.13,4.92 M3:C2.1 | v18.86,5.71 19.65,4.92
VDD  (via drill 0.25)
  Top 0.203: v12.19,10.48 13.14,10.48 M2:C2.1 | M2:U$1.9 18.07,10.32 17.27,10.32 v17.27,9.68 17.27,9.05 v14.57,9.05 | M5:C3.1 24.89,16.35 25.69,16.35 27.27,16.35 M5:C2.1 27.45,16.27 28.45,17.27 28.45,20.83 27.43,21.84 21.72,21.84 | 21.88,16.51 M5:U2.3 | 21.88,19.05 M5:U2.6 21.72,19.21 21.72,21.84 | v13.46,23.97 11.72,23.97 M1:U1.2 | v21.24,23.97 21.72,23.49 21.72,21.84 | v19.49,8.57 21.72,8.57 21.72,14.92 M5:U2.1 | M5:U2.3 22.83,16.66 | M5:U2.1 22.83,15.06 | 24.46,16.61 arc-90 M5:C3.1 | M5:U2.1 24.85,15.06 M5:C3.1 | M5:U2.3 24.85,16.66 M5:C3.1
  Bottom 0.203: 17.27,6.67 17.43,6.67 M3:U4.4 | 17.27,6.67 16.95,6.67 M3:U4.3 | 17.27,6.67 17.27,8.41 | 17.27,8.41 v17.27,9.68 | 17.27,8.41 17.75,8.41 M3:C1.1 17.91,8.57 v19.49,8.57 | v21.24,23.97 v13.46,23.97 | v14.57,9.05 13.3,10.32 M1:C1.1 13.14,10.48 v12.19,10.48 9.97,10.48 M3:L1.1 9.81,10.48 6.95,10.48 M4:C1.1 6.79,10.48 6.48,10.48 4.73,12.22 4.73,13.1 M4:U5.5 3.78,14.13 4.57,14.92 4.57,15.72 M1:R1.2 4.53,16 J1.1
  pour Route2: 2.79,19.84 7.54,18.34 11.53,15.67 14.71,11.99 16.59,7.34 16.94,2.49 15.85,-2.08 13.67,-6.32 10.19,-9.83 5.66,-11.99 1.02,-12.8 -3.61,-12.22 -8.15,-10.16 -11.86,-6.88 -14.27,-2.64 -15.37,2.06 -15.11,6.98 -13.39,11.48 -10.41,15.44 -6.45,18.19 -1.96,19.61